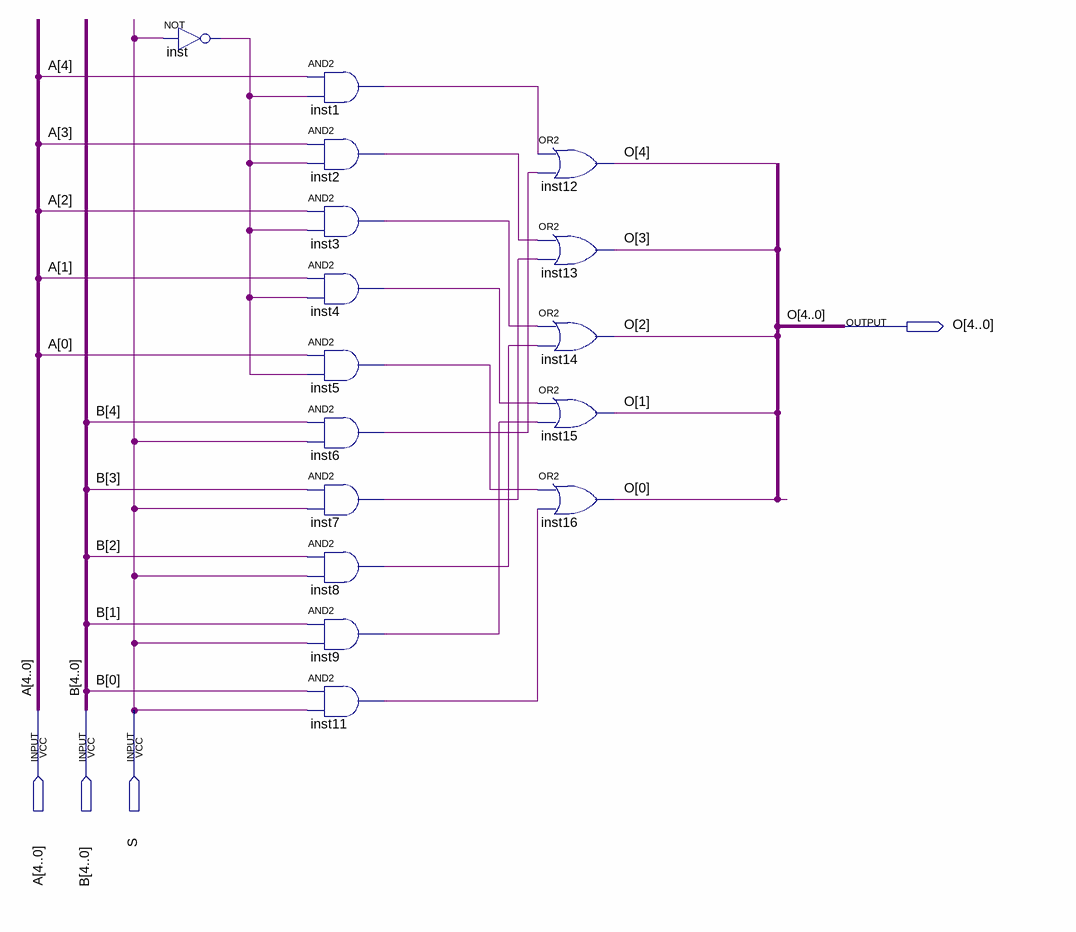
[diagram p0: schematic sheet]
// Quartus schematic MUX2x1.bdf as structural Verilog: 16 symbols, 4 pins
module MUX2x1 (
  input  [4:0] A,
  input  [4:0] B,
  input  S,
  output [4:0] O
);

  wire inst1_out, inst2_out, inst3_out, inst4_out, inst5_out, inst6_out, inst7_out, inst8_out, inst9_out,
       inst11_out, inst_out;

  not inst (inst_out, S);
  and inst1 (inst1_out, A[4], inst_out);
  and inst2 (inst2_out, A[3], inst_out);
  and inst3 (inst3_out, A[2], inst_out);
  and inst4 (inst4_out, A[1], inst_out);
  and inst5 (inst5_out, A[0], inst_out);
  and inst6 (inst6_out, B[4], S);
  and inst7 (inst7_out, B[3], S);
  and inst8 (inst8_out, B[2], S);
  and inst9 (inst9_out, B[1], S);
  and inst11 (inst11_out, B[0], S);
  or inst12 (O[4], inst1_out, inst6_out);
  or inst13 (O[3], inst2_out, inst7_out);
  or inst14 (O[2], inst3_out, inst8_out);
  or inst15 (O[1], inst4_out, inst9_out);
  or inst16 (O[0], inst5_out, inst11_out);
endmodule
